# EAGLE design lcd_booster_mk2 (EAGLE 6.1)
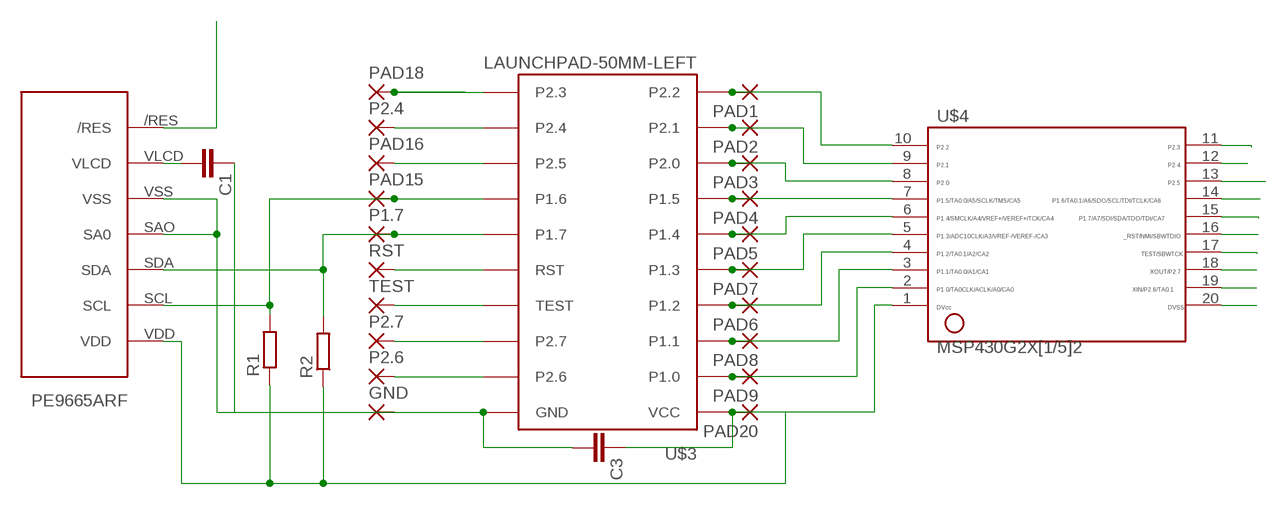
[diagram p0: schematic, sheet 1]

## Parts
C1  C-EUC1206  [C1206]
C3  C-EUC1206  [C1206]
GND  1,6/0,9  [1,6/0,9]
P1.7  1,6/0,9  [1,6/0,9]
P2.4  1,6/0,9  [1,6/0,9]
P2.6  1,6/0,9  [1,6/0,9]
P2.7  1,6/0,9  [1,6/0,9]
PAD1  1,6/0,9  [1,6/0,9]
PAD2  1,6/0,9  [1,6/0,9]
PAD3  1,6/0,9  [1,6/0,9]
PAD4  1,6/0,9  [1,6/0,9]
PAD5  1,6/0,9  [1,6/0,9]
PAD6  1,6/0,9  [1,6/0,9]
PAD7  1,6/0,9  [1,6/0,9]
PAD8  1,6/0,9  [1,6/0,9]
PAD9  1,6/0,9  [1,6/0,9]
PAD15  1,6/0,9  [1,6/0,9]
PAD16  1,6/0,9  [1,6/0,9]
PAD18  1,6/0,9  [1,6/0,9]
PAD20  1,6/0,9  [1,6/0,9]
R1  R-EU_M1206  [M1206]
R2  R-EU_M1206  [M1206]
RST  1,6/0,9  [1,6/0,9]
TEST  1,6/0,9  [1,6/0,9]
U$2  PE9665ARF  [PE9665ARF]
U$3  LAUNCHPAD-50MM-LEFT  [LAUNCHPAD-50MM-LEFT]
U$4  G2X[1/5]2---PW20  [PW20]

## Nets
GND: C1.1 C3.2 GND.1(P) U$2.SAO(SA0) U$2.VSS U$3.GND U$4.20
N$1: PAD1.1(P) U$3.P2.2 U$4.10
N$6: C1.2 U$2.VLCD
N$7: PAD2.1(P) U$3.P2.1 U$4.9
N$8: U$2./RES
N$9: PAD3.1(P) U$3.P2.0 U$4.8
N$11: PAD4.1(P) U$3.P1.5 U$4.7
N$13: PAD5.1(P) U$3.P1.4 U$4.6
N$14: PAD6.1(P) U$3.P1.2 U$4.4
N$15: PAD8.1(P) U$3.P1.1 U$4.3
N$16: PAD9.1(P) U$3.P1.0 U$4.2
N$25: C3.1 PAD20.1(P) R1.1 R2.1 U$2.VDD U$3.VCC U$4.1
N$27: PAD7.1(P) U$3.P1.3 U$4.5
P1.6: PAD15.1(P) R1.2 U$2.SCL U$3.P1.6 U$4.14
P1.7: P1.7.1(P) R2.2 U$2.SDA U$3.P1.7 U$4.15
P2.3: PAD18.1(P) U$3.P2.3 U$4.11
P2.4: P2.4.1(P) U$3.P2.4 U$4.12
P2.5: PAD16.1(P) U$3.P2.5 U$4.13
P2.6: P2.6.1(P) U$3.P2.6 U$4.19
P2.7: P2.7.1(P) U$3.P2.7 U$4.18
RST: RST.1(P) U$3.RST U$4.16
TEST: TEST.1(P) U$3.TEST U$4.17

## Library data of the parts
C1 C3 = rcl:C-EU: CAPACITOR, European symbol
GND P1.7 P2.4 P2.6 P2.7 PAD1-PAD9 PAD15 PAD16 PAD18 PAD20 RST TEST = wirepad:1,6/0,9: THROUGH-HOLE PAD
R1 R2 = resistor:R-EU_: RESISTOR, European symbol
U$2 = apus:PE9665ARF
U$3 = TI_launchpad:LAUNCHPAD: MSP-EXP430G2 LaunchPad Booster Pack layouts. LAUNCHPAD: Full-size board LAUNCHPAD-50MM: 50x50mm board covering the button area LAUNCHPAD-50MM-LEFT: 50x50mm board leaving the button area open. Tall LaunchPad components marked on Reference for reference.
U$4 = TI_MSP430_v16:G2X[1/5]2---PW20: MSP430G2X[1/5]2 MSP430G2x52, MSP430G2x12 TSSOP (PW) 20 Pin Package http://focus.ti.com/docs/prod/folders/print/msp430g2452.html

## Board
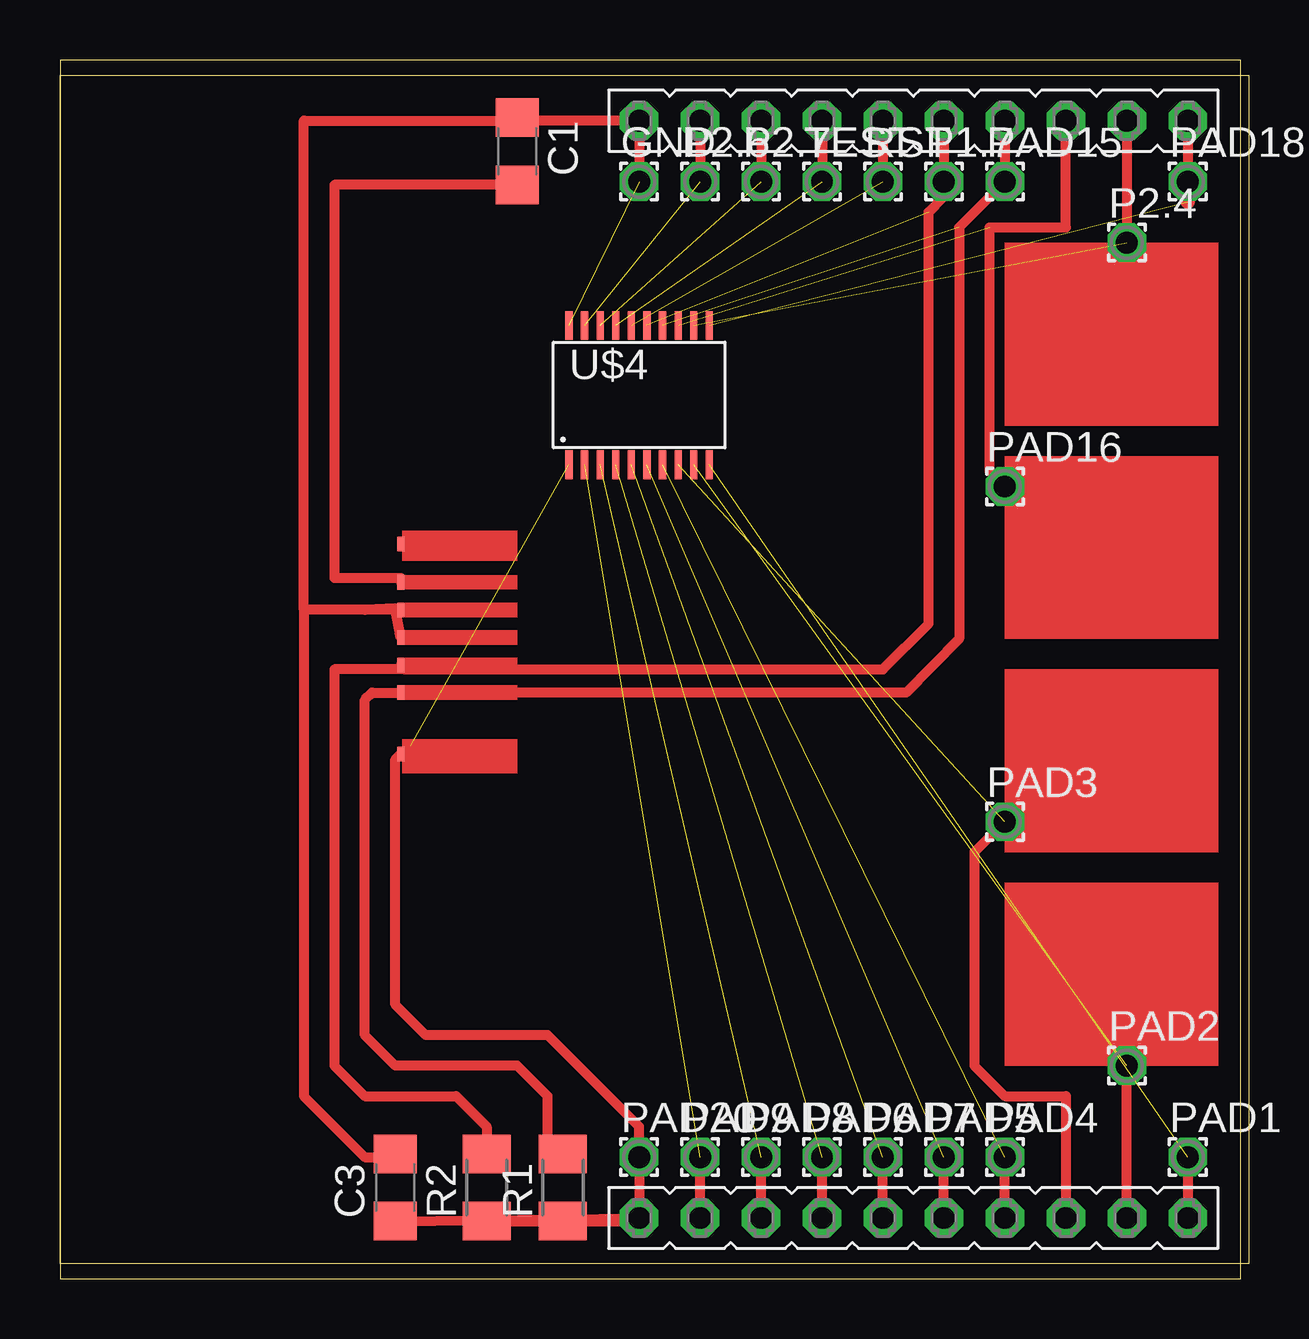
[diagram p1: board, top side]

Size 49.2 x 50.79 mm. Coordinates in mm from the lower left corner, seen from the top.
Outline: 0,0 49.2,0 49.2,50.79 0,50.79 0,0
Copper layers (1*16): Top 0.035mm / dielectric 1.5mm / Bottom 0.035mm
Design rules: minimum track width 6mil, minimum drill 12mil, track to track 6mil, track to pad 6mil, pad to pad 6mil, via to via 6mil, smd to smd 0mil, copper to edge 10mil, drill to drill 10mil, minimum pad ring 10mil, minimum via ring 6mil, stop-mask expansion 2mil, vias tented up to drill 100mil, thermal gap 10mil

### Footprints (pad centres in the part's own frame; a part is rotated, then mirrored left to right if it is on the bottom)
C1206 = smd 1.6 x 1.8: 1 -1.4,0; 2 1.4,0
1,6/0,9 = drill 0.914 pad 1.6 octagon: 1 0,0
M1206 = smd 1.6 x 2: 1 -1.4,0; 2 1.4,0
PE9665ARF = smd 0.61 x 0.305: /RES 6.5,4.85; SAO 2.6,4.85; SCL 0.3,4.85; SDA 1.45,4.85; VDD -2.25,4.85; VLCD 4.9,4.85; VSS 3.75,4.85
LAUNCHPAD-50MM-LEFT = drill 0.914 pad 1.6 octagon: GND 24.13,48.26; P1.0 26.67,2.54; P1.1 29.21,2.54; P1.2 31.75,2.54; P1.3 34.29,2.54; P1.4 36.83,2.54; P1.5 39.37,2.54; P1.6 39.37,48.26; P1.7 36.83,48.26; P2.0 41.91,2.54; P2.1 44.45,2.54; P2.2 46.99,2.54; P2.3 46.99,48.26; P2.4 44.45,48.26; P2.5 41.91,48.26; P2.6 26.67,48.26; P2.7 29.21,48.26; RST 34.29,48.26; TEST 31.75,48.26; VCC 24.13,2.54
PW20 = smd 0.3 x 1.2: 1 -2.925,-2.9; 2 -2.275,-2.9; 3 -1.625,-2.9; 4 -0.975,-2.9; 5 -0.325,-2.9; 6 0.325,-2.9; 7 0.975,-2.9; 8 1.625,-2.9; 9 2.275,-2.9; 10 2.925,-2.9; 11 2.925,2.9; 12 2.275,2.9; 13 1.625,2.9; 14 0.975,2.9; 15 0.325,2.9; 16 -0.325,2.9; 17 -0.975,2.9; 18 -1.625,2.9; 19 -2.275,2.9; 20 -2.925,2.9

### Placement (x,y rotation side)
C1  19.05,46.99 270 top
C3  13.97,3.81 90 top
GND  24.13,45.72 0 top
P1.7  36.83,45.72 0 top
P2.4  44.45,43.18 0 top
P2.6  26.67,45.72 0 top
P2.7  29.21,45.72 0 top
PAD1  46.99,5.08 0 top
PAD2  44.45,8.89 0 top
PAD3  39.37,19.05 0 top
PAD4  39.37,5.08 0 top
PAD5  36.83,5.08 0 top
PAD6  31.75,5.08 0 top
PAD7  34.29,5.08 0 top
PAD8  29.21,5.08 0 top
PAD9  26.67,5.08 0 top
PAD15  39.37,45.72 0 top
PAD16  39.37,33.02 0 top
PAD18  46.99,45.72 0 top
PAD20  24.13,5.08 0 top
R1  20.95,3.81 90 top
R2  17.78,3.81 90 top
RST  34.29,45.72 0 top
TEST  31.75,45.72 0 top
U$2  19.05,24.13 90 top
U$3  0,0 0 top
U$4  24.13,36.83 0 top

### Tracks (layer width: path | path; a pad name or v marks a point on that pad's centre or on a via)
GND  (1 unrouted)
  Top 0.406: GND.1 U$3.GND 19.05,48.26 | U$2.VSS 12.7,27.88 | 12.7,27.88 10.16,27.88 | 10.16,27.88 10.16,48.26 19.05,48.26 | 19.05,48.26 C1.1 | 10.16,27.88 10.16,7.62 12.7,5.08 13.84,5.08 C3.2 | U$2.SAO 13.97,27.94 12.7,27.88
N$1  (1 unrouted)
  Top 0.406: PAD1.1 U$3.P2.2
N$6
  Top 0.406: C1.2 11.43,45.59 11.43,29.21 14.2,29.21 U$2.VLCD
N$7  (1 unrouted)
  Top 0.406: U$3.P2.1 PAD2.1
N$9  (1 unrouted)
  Top 0.406: PAD3.1 38.1,17.78 38.1,8.89 39.37,7.62 41.91,7.62 U$3.P2.0
N$11  (1 unrouted)
  Top 0.406: U$3.P1.5 PAD4.1
N$13  (1 unrouted)
  Top 0.406: U$3.P1.4 PAD5.1
N$14  (1 unrouted)
  Top 0.406: U$3.P1.2 PAD6.1
N$15  (1 unrouted)
  Top 0.406: U$3.P1.1 PAD8.1
N$16  (1 unrouted)
  Top 0.406: U$3.P1.0 PAD9.1
N$25  (1 unrouted)
  Top 0.406: R2.1 R1.1 24.13,2.41 U$3.VCC | C3.1 U$3.VCC | 14.61,22.23 U$2.VDD 13.97,21.65 13.97,11.43 15.24,10.16 20.32,10.16 24.13,6.35 PAD20.1 U$3.VCC
N$27  (1 unrouted)
  Top 0.406: U$3.P1.3 PAD7.1
P1.6  (1 unrouted)
  Top 0.406: U$3.P1.6 PAD15.1 37.47,43.81 37.47,26.67 35.26,24.43 U$2.SCL 13,24.43 12.7,24.13 12.7,10.16 13.97,8.89 19.05,8.89 20.32,7.62 20.32,5.84 R1.2
P1.7  (1 unrouted)
  Top 0.406: U$3.P1.7 P1.7.1 36.83,45.09 36.2,44.45 36.2,27.3 34.29,25.4 14.38,25.4 | U$2.SDA 14.38,25.4 | 14.38,25.4 11.43,25.4 11.43,8.89 12.7,7.62 16.51,7.62 17.78,6.35 R2.2 17.78,5.08
P2.3  (1 unrouted)
  Top 0.406: U$3.P2.3 PAD18.1
  Top 0.61: 46.99,44.88 PAD18.1
P2.4  (1 unrouted)
  Top 0.406: U$3.P2.4 P2.4.1
P2.5  (1 unrouted)
  Top 0.406: PAD16.1 38.73,33.66 38.73,43.81 41.91,43.81 U$3.P2.5
P2.6  (1 unrouted)
  Top 0.406: U$3.P2.6 P2.6.1
P2.7  (1 unrouted)
  Top 0.406: U$3.P2.7 P2.7.1
RST  (1 unrouted)
  Top 0.406: U$3.RST RST.1
TEST  (1 unrouted)
  Top 0.406: U$3.TEST TEST.1
(copper drawn outside any net)
  shapes: Top area x4